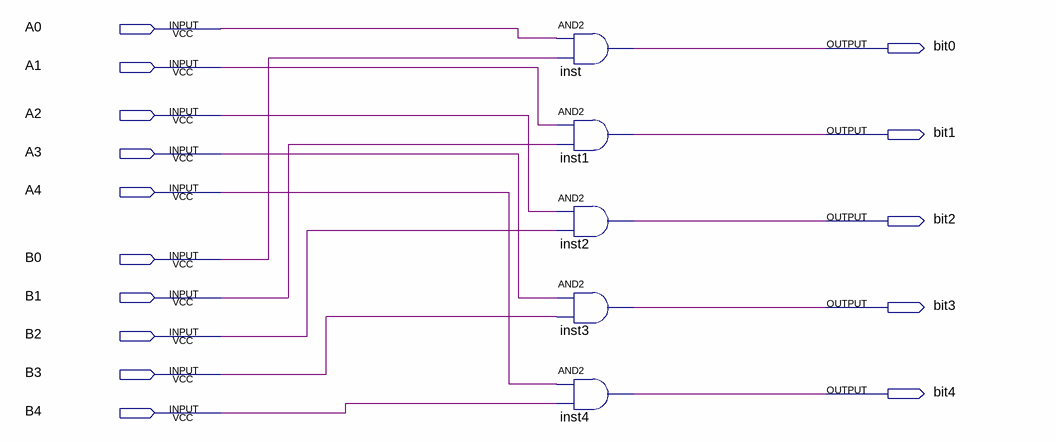
[diagram p0: schematic sheet]
// Quartus schematic bloco_AandB.bdf as structural Verilog: 5 symbols, 15 pins
module bloco_AandB (
  input  A0,
  input  A1,
  input  A2,
  input  A3,
  input  A4,
  input  B0,
  input  B1,
  input  B2,
  input  B3,
  input  B4,
  output bit0,
  output bit1,
  output bit2,
  output bit3,
  output bit4
);

  and inst (bit0, A0, B0);
  and inst1 (bit1, A1, B1);
  and inst2 (bit2, A2, B2);
  and inst3 (bit3, A3, B3);
  and inst4 (bit4, A4, B4);
endmodule
